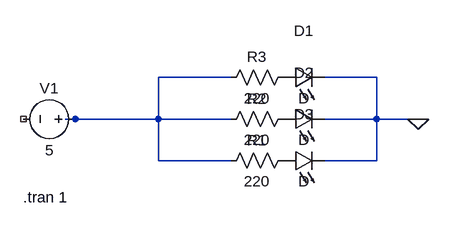
[diagram p0: schematic led_sequence_arduino.asc]
led_sequence_arduino.asc, the LTspice schematic file:
Version 4.1
SHEET 1 880 680
WIRE 48 -144 -64 -144
WIRE 272 -144 192 -144
WIRE -192 -80 -208 -80
WIRE -64 -80 -64 -144
WIRE -64 -80 -192 -80
WIRE 48 -80 -64 -80
WIRE 272 -80 272 -144
WIRE 272 -80 192 -80
WIRE 320 -80 272 -80
WIRE -64 -16 -64 -80
WIRE 48 -16 -64 -16
WIRE 272 -16 272 -80
WIRE 272 -16 192 -16
FLAG 336 -80 0
SYMBOL voltage -176 -80 R90
WINDOW 0 -32 56 VBottom 2
WINDOW 3 32 56 VTop 2
WINDOW 123 0 0 Left 0
WINDOW 39 0 0 Left 0
SYMATTR InstName V1
SYMATTR Value 5
SYMBOL res 144 -32 R90
WINDOW 0 0 56 VBottom 2
WINDOW 3 32 56 VTop 2
SYMATTR InstName R1
SYMATTR Value 220
SYMBOL res 144 -96 R90
WINDOW 0 0 56 VBottom 2
WINDOW 3 32 56 VTop 2
SYMATTR InstName R2
SYMATTR Value 220
SYMBOL res 144 -160 R90
WINDOW 0 0 56 VBottom 2
WINDOW 3 32 56 VTop 2
SYMATTR InstName R3
SYMATTR Value 220
SYMBOL LED 128 -128 R270
WINDOW 0 72 32 VTop 2
WINDOW 3 0 32 VBottom 2
SYMATTR InstName D1
SYMBOL LED 128 -64 R270
WINDOW 0 72 32 VTop 2
WINDOW 3 0 32 VBottom 2
SYMATTR InstName D2
SYMBOL LED 128 0 R270
WINDOW 0 72 32 VTop 2
WINDOW 3 0 32 VBottom 2
SYMATTR InstName D3
TEXT -272 40 Left 2 !.tran 1

The netlist it stands for:
* led_sequence_arduino.asc
V1 N001 NC_01 5
R1 P001 N001 220
R2 P002 N001 220
R3 P003 N001 220
D1 P003 N002 D
D2 P002 N002 D
D3 P001 N002 D
.model D D
.lib standard.dio
.tran 1
.backanno
.end